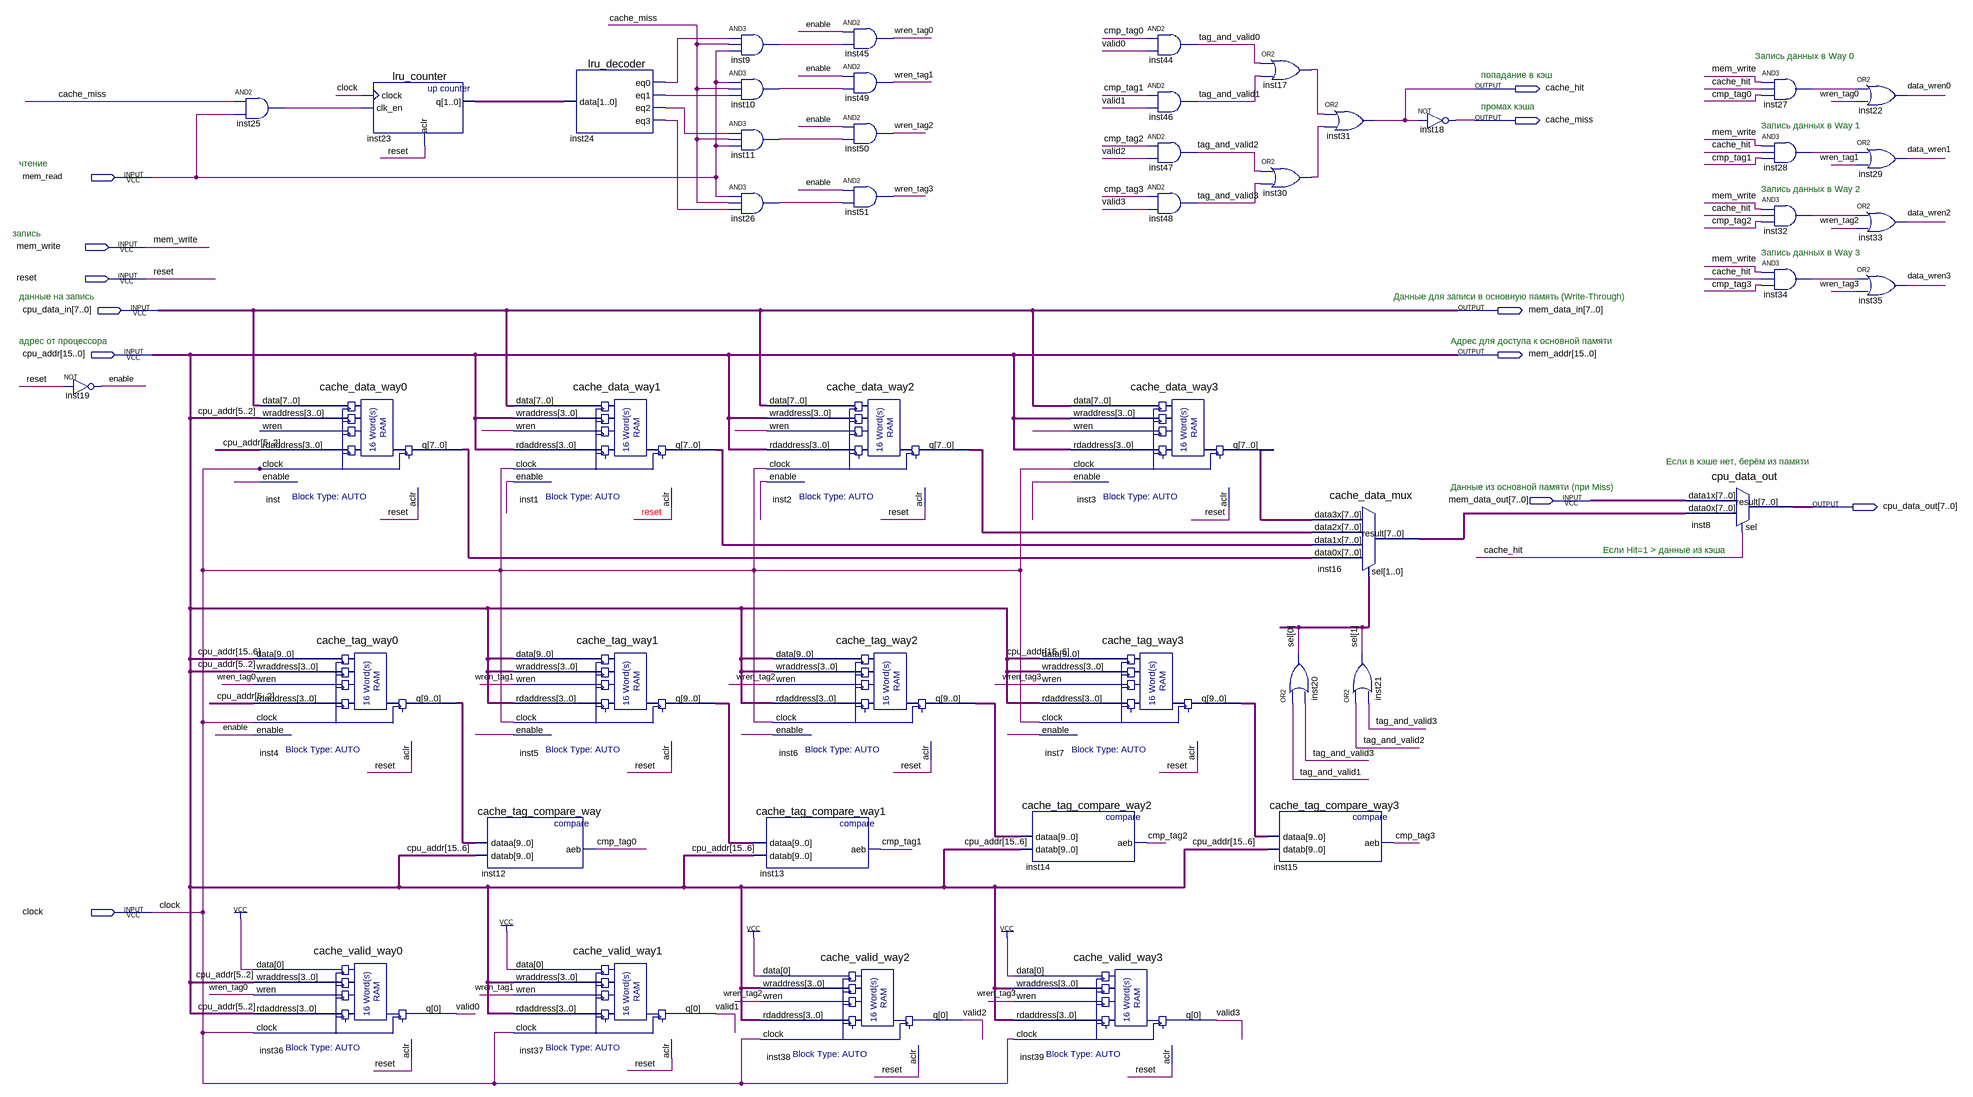
[diagram p0: schematic sheet]
// Quartus schematic cache.bdf as structural Verilog: 48 symbols, 12 pins
module cache (
  input  mem_read,
  input  mem_write,
  input  reset,
  input  [7:0] cpu_data_in,
  input  [15:0] cpu_addr,
  input  [7:0] mem_data_out,
  input  clock,
  output cache_hit,
  output cache_miss,
  output [7:0] mem_data_in,
  output [15:0] mem_addr,
  output [7:0] cpu_data_out
);

  wire cmp_tag0, cmp_tag1, cmp_tag2, cmp_tag3, data_wren0, data_wren1, data_wren2, data_wren3, enable,
       inst9_out, inst10_out, inst11_out, inst17_out, inst24_eq0, inst24_eq1, inst24_eq2, inst24_eq3,
       inst25_out, inst26_out, inst27_out, inst28_out, inst30_out, inst32_out, inst34_out, tag_and_valid0,
       tag_and_valid1, tag_and_valid2, tag_and_valid3, valid0, valid1, valid2, valid3, wren_tag0, wren_tag1,
       wren_tag2, wren_tag3;
  wire [1:0] inst23_q, sel;
  wire [7:0] inst1_q, inst2_q, inst3_q, inst16_result, inst_q;
  wire [9:0] inst4_q, inst5_q, inst6_q, inst7_q;

  not inst19 (enable, reset);
  and inst25 (inst25_out, cache_miss, mem_read);
  cache_data_way0 inst (
    .data(cpu_data_in), .wraddress(cpu_addr[5:2]), .rdaddress(cpu_addr[5:2]), .clock(clock), .enable(enable),
    .aclr(reset), .q(inst_q));  // open: wren
  cache_tag_way0 inst4 (
    .data(cpu_addr[15:6]), .wraddress(cpu_addr[5:2]), .wren(wren_tag0), .rdaddress(cpu_addr[5:2]),
    .clock(clock), .enable(enable), .aclr(reset), .q(inst4_q));
  cache_valid_way0 inst36 (
    .data(1'b1), .wraddress(cpu_addr[5:2]), .wren(wren_tag0), .rdaddress(cpu_addr[5:2]), .clock(clock),
    .aclr(reset), .q(valid0));
  lru_counter inst23 (.clock(clock), .clk_en(inst25_out), .aclr(reset), .q(inst23_q));
  cache_data_way1 inst1 (
    .data(cpu_data_in), .wraddress(cpu_addr[5:2]), .wren(data_wren1), .rdaddress(cpu_addr[5:2]),
    .clock(clock), .enable(enable), .aclr(reset), .q(inst1_q));
  cache_tag_way1 inst5 (
    .data(cpu_addr[15:6]), .wraddress(cpu_addr[5:2]), .wren(wren_tag1), .rdaddress(cpu_addr[5:2]),
    .clock(clock), .enable(enable), .aclr(reset), .q(inst5_q));
  cache_tag_compare_way inst12 (.dataa(inst4_q), .datab(cpu_addr[15:6]), .aeb(cmp_tag0));
  cache_valid_way1 inst37 (
    .data(1'b1), .wraddress(cpu_addr[5:2]), .wren(wren_tag1), .rdaddress(cpu_addr[5:2]), .clock(clock),
    .aclr(reset), .q(valid1));
  lru_decoder inst24 (.data(inst23_q), .eq0(inst24_eq0), .eq1(inst24_eq1), .eq2(inst24_eq2), .eq3(inst24_eq3));
  and inst9 (inst9_out, inst24_eq0, cache_miss, mem_read);
  and inst10 (inst10_out, mem_read, cache_miss, inst24_eq1);
  and inst11 (inst11_out, inst24_eq2, cache_miss, mem_read);
  and inst26 (inst26_out, mem_read, cache_miss, inst24_eq3);
  cache_data_way2 inst2 (
    .data(cpu_data_in), .wraddress(cpu_addr[5:2]), .wren(data_wren2), .rdaddress(cpu_addr[5:2]),
    .clock(clock), .enable(enable), .aclr(reset), .q(inst2_q));
  cache_tag_way2 inst6 (
    .data(cpu_addr[15:6]), .wraddress(cpu_addr[5:2]), .wren(wren_tag2), .rdaddress(cpu_addr[5:2]),
    .clock(clock), .enable(enable), .aclr(reset), .q(inst6_q));
  cache_tag_compare_way1 inst13 (.dataa(inst5_q), .datab(cpu_addr[15:6]), .aeb(cmp_tag1));
  cache_valid_way2 inst38 (
    .data(1'b1), .wraddress(cpu_addr[5:2]), .wren(wren_tag2), .rdaddress(cpu_addr[5:2]), .clock(clock),
    .aclr(reset), .q(valid2));
  and inst45 (wren_tag0, enable, inst9_out);
  and inst49 (wren_tag1, enable, inst10_out);
  and inst50 (wren_tag2, enable, inst11_out);
  and inst51 (wren_tag3, enable, inst26_out);
  cache_tag_compare_way2 inst14 (.dataa(inst6_q), .datab(cpu_addr[15:6]), .aeb(cmp_tag2));
  cache_valid_way3 inst39 (
    .data(1'b1), .wraddress(cpu_addr[5:2]), .wren(wren_tag3), .rdaddress(cpu_addr[5:2]), .clock(clock),
    .aclr(reset), .q(valid3));
  cache_data_way3 inst3 (
    .data(cpu_data_in), .wraddress(cpu_addr[5:2]), .wren(data_wren3), .rdaddress(cpu_addr[5:2]),
    .clock(clock), .enable(enable), .aclr(reset), .q(inst3_q));
  cache_tag_way3 inst7 (
    .data(cpu_addr[15:6]), .wraddress(cpu_addr[5:2]), .wren(wren_tag3), .rdaddress(cpu_addr[5:2]),
    .clock(clock), .enable(enable), .aclr(reset), .q(inst7_q));
  and inst44 (tag_and_valid0, cmp_tag0, valid0);
  and inst46 (tag_and_valid1, cmp_tag1, valid1);
  and inst47 (tag_and_valid2, cmp_tag2, valid2);
  and inst48 (tag_and_valid3, cmp_tag3, valid3);
  or inst17 (inst17_out, tag_and_valid0, tag_and_valid1);
  or inst30 (inst30_out, tag_and_valid2, tag_and_valid3);
  or inst20 (sel[0], tag_and_valid1, tag_and_valid3);
  cache_tag_compare_way3 inst15 (.dataa(inst7_q), .datab(cpu_addr[15:6]), .aeb(cmp_tag3));
  or inst31 (cache_hit, inst17_out, inst30_out);
  cache_data_mux inst16 (
    .data3x(inst3_q), .data2x(inst2_q), .data1x(inst1_q), .data0x(inst_q), .sel(sel), .result(inst16_result));
  or inst21 (sel[1], tag_and_valid2, tag_and_valid3);
  not inst18 (cache_miss, cache_hit);
  cpu_data_out inst8 (.data1x(mem_data_out), .data0x(inst16_result), .sel(cache_hit), .result(cpu_data_out));
  and inst27 (inst27_out, mem_write, cache_hit, cmp_tag0);
  and inst28 (inst28_out, mem_write, cache_hit, cmp_tag1);
  and inst32 (inst32_out, mem_write, cache_hit, cmp_tag2);
  and inst34 (inst34_out, mem_write, cache_hit, cmp_tag3);
  or inst22 (data_wren0, inst27_out, wren_tag0);
  or inst29 (data_wren1, inst28_out, wren_tag1);
  or inst33 (data_wren2, inst32_out, wren_tag2);
  or inst35 (data_wren3, inst34_out, wren_tag3);

  assign mem_addr = cpu_addr;
  assign mem_data_in = cpu_data_in;

  // Notes on the sheet:
  //   Запись данных в Way 0
  //   попадание в кэш
  //   промах кэша
  //   Запись данных в Way 1
  //   чтение
  //   Запись данных в Way 2
  //   запись
  //   Запись данных в Way 3
  //   данные на запись
  //   Данные для записи в основную память (Write-Through)
  //   адрес от процессора
  //   Адрес для доступа к основной памяти
  //   Если в кэше нет, берём из памяти
  //   Данные из основной памяти (при Miss)
  //   Если Hit=1 > данные из кэша 
endmodule
